# EAGLE design arduino-shield-xyzhbridge-stepper-v1 (EAGLE 9.6.2)
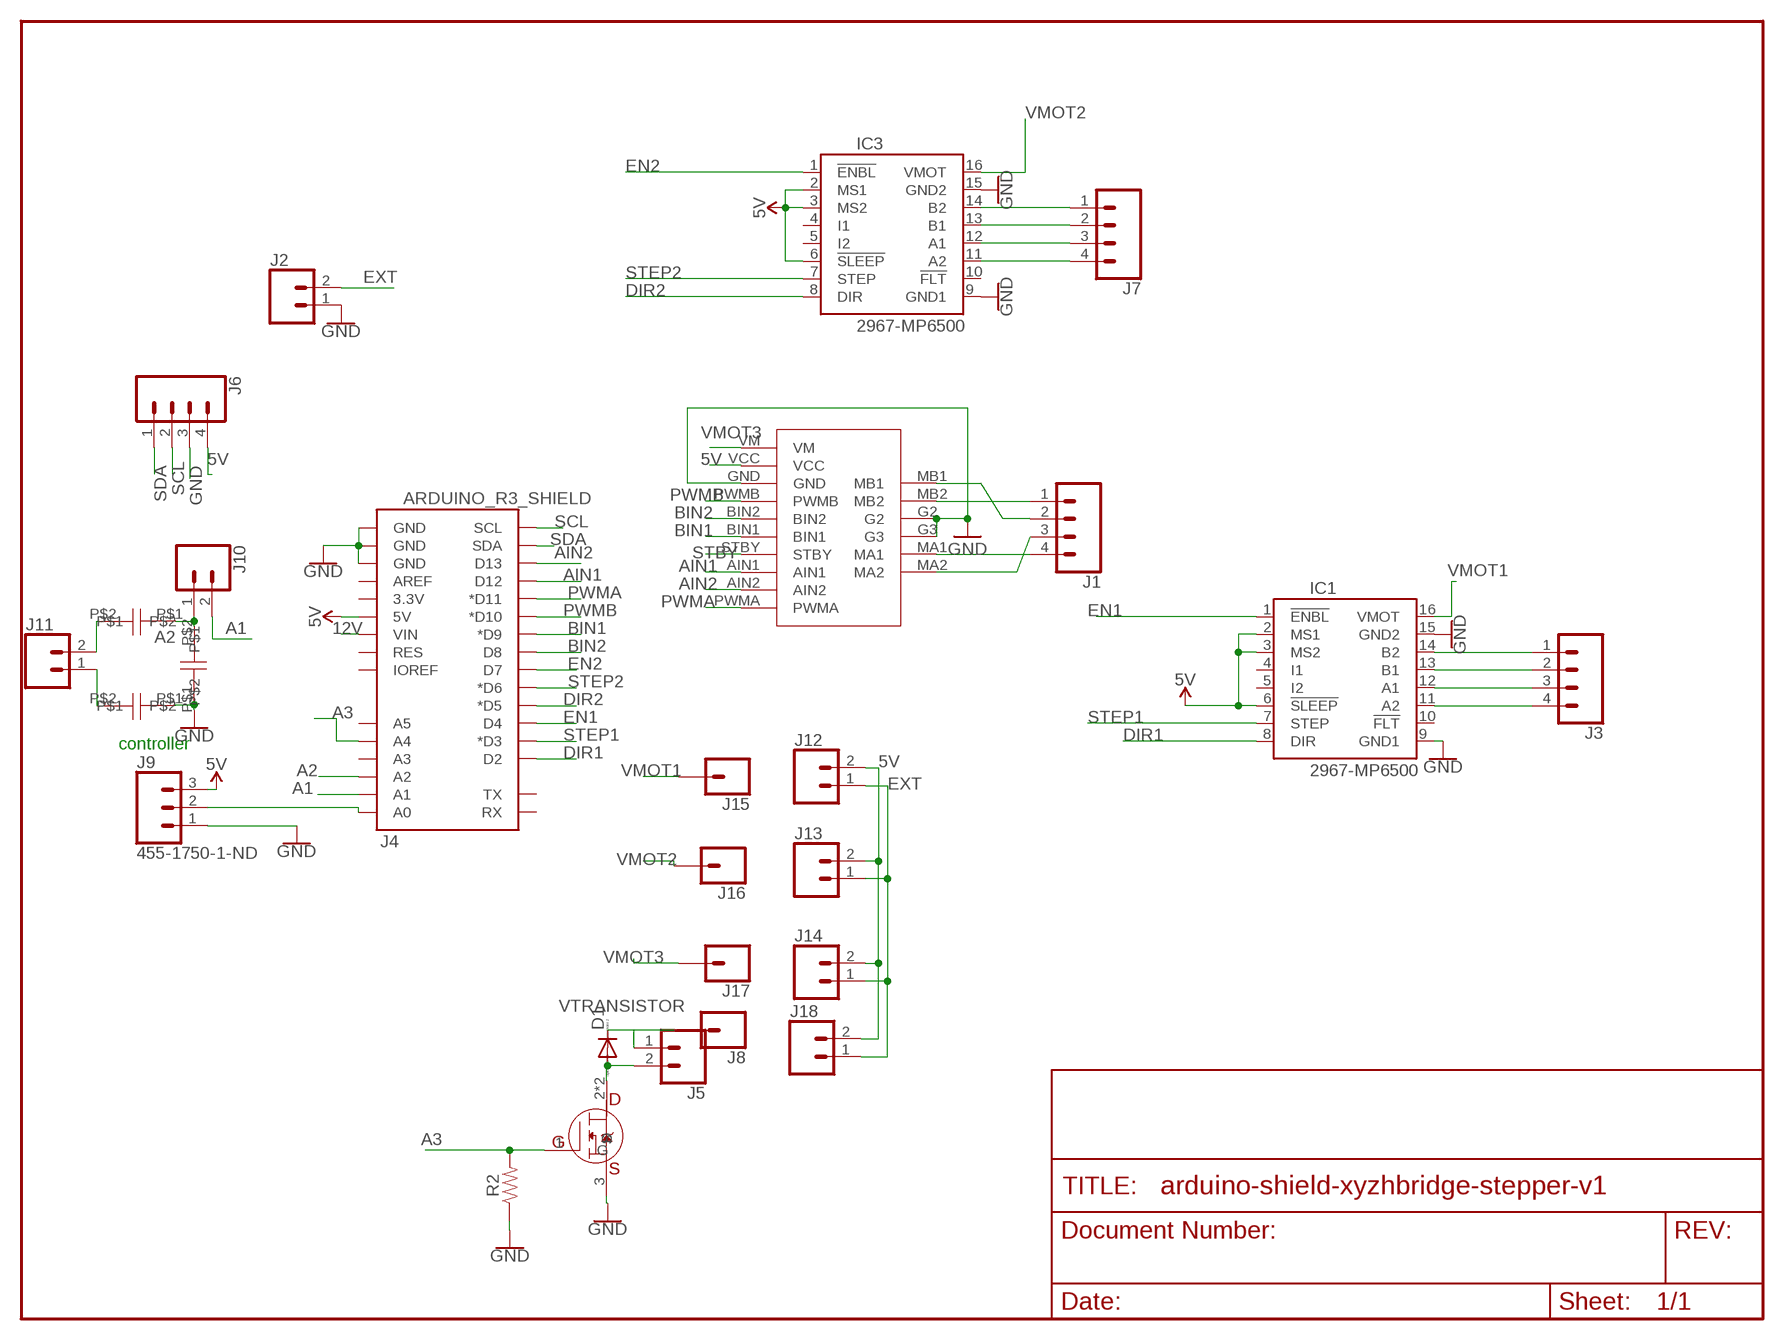
[diagram p0: schematic, sheet 1]

## Parts
D1  DIODE-DO-214AC  [DO-214AC]
IC1  2967-MP6500  [MP6500]
IC3  2967-MP6500  [MP6500]
J1  CONN_04  [1X04]
J2  CONN_02  [1X02]
J3  CONN_04  [1X04]
J4  ARDUINO_R3_SHIELD  [UNO_R3_SHIELD]
J5  CONN_02  [1X02]
J6  CONN_04  [1X04]
J7  CONN_04  [1X04]
J8  CONN_01  [1X01]
J9  455-1750-1-ND  CONN_03  [1X03]
J10  CONN_02  [1X02]
J11  CONN_02  [1X02]
J12  CONN_02  [1X02]
J13  CONN_02  [1X02]
J14  CONN_02  [1X02]
J15  CONN_01  [1X01]
J16  CONN_01  [1X01]
J17  CONN_01  [1X01]
J18  CONN_02  [1X02]
R2  RESISTORAXIAL-0.3  [AXIAL-0.3]
U$1  ADAFRUIT-TB6612  [ADAFRUIT-TB6612]
U$2  AXIALCAP  [AXIALCAP]
U$3  AXIALCAP  [AXIALCAP]
U$4  AXIALCAP  [AXIALCAP]
U$5  IRFL024NPBF  [SOT223]

## Nets
5V: IC1.2(MS1) IC1.3(MS2) IC1.6(!SLEEP) IC3.2(MS1) IC3.3(MS2) IC3.6(!SLEEP) J4.5V J6.4 J9.3 J12.2 J13.2 J14.2 J18.2 U$1.VCC
12V: J4.VIN
A1: J4.A1 J10.2
A2: J4.A2 J10.1 U$3.P$2 U$4.P$1
A3: J4.A4 R2.P$2 U$5.1(G)
AIN1: J4.D12 U$1.AIN1
AIN2: J4.D13 U$1.AIN2
BIN1: J4.D9(*D9) U$1.BIN1
BIN2: J4.D8 U$1.BIN2
DIR1: IC1.8(DIR) J4.D2
DIR2: IC3.8(DIR) J4.D5(*D5)
EN1: IC1.1(!ENBL) J4.D4
EN2: IC3.1(!ENBL) J4.D7
EXT: J2.2 J12.1 J13.1 J14.1 J18.1
GND [vcc]: IC1.9(GND1) IC1.15(GND2) IC3.9(GND1) IC3.15(GND2) J2.1 J4.GND@0(GND) J4.GND@1(GND) J4.GND@2(GND) J6.3 J9.1 R2.P$1 U$1.G2 U$1.G3 U$1.GND U$2.P$1 U$3.P$1 U$5.3(S)
N$1: IC3.14(B2) J7.1
N$4: IC3.13(B1) J7.2
N$5: IC1.14(B2) J3.1
N$6: IC1.13(B1) J3.2
N$7: IC1.12(A1) J3.3
N$8: IC1.11(A2) J3.4
N$11: J1.2 U$1.MB1
N$12: J1.1 U$1.MB2
N$13: IC3.12(A1) J7.3
N$14: IC3.11(A2) J7.4
N$15: J4.A0 J9.2
N$16: J1.4 U$1.MA1
N$17: J1.3 U$1.MA2
N$18: D1.A J5.2 U$5.2(D) U$5.4(D)
N$19: J11.2 U$4.P$2
N$22: J11.1 U$2.P$2
PWMA: J4.D11(*D11) U$1.PWMA
PWMB: J4.D10(*D10) U$1.PWMB
SCL: J4.SCL J6.2
SDA: J4.SDA J6.1
STBY: U$1.STBY
STEP1: IC1.7(STEP) J4.D3(*D3)
STEP2: IC3.7(STEP) J4.D6(*D6)
VMOT1: IC1.16(VMOT) J15.1
VMOT2: IC3.16(VMOT) J16.1
VMOT3: J17.1 U$1.VM
VTRANSISTOR: D1.C J5.1 J8.1
Unconnected: IC1.4(I1) IC1.5(I2) IC1.10(!FLT) IC3.4(I1) IC3.5(I2) IC3.10(!FLT) J4.3.3V J4.A3 J4.A5 J4.AREF J4.IOREF J4.RES J4.RX J4.TX

## Notes on the sheet
- controller

## Library data of the parts
D1 = diode:DIODE-: DIODE
IC1 IC3 = pololu-stepper-driver:2967-MP6500: MP6500 Stepper Motor Driver Carrier; Potentiometer Current Control (Header Pins Soldered) #2967 MP6500 Stepper Motor Driver Carrier; Potentiometer Current Control (Header Pins Soldered) <https://www.pololu.com/product/2967> in Japan, Suzaku Lab. Ltd. <https://suzakugiken.jp/> #2967 MP6500ステッピングモータドライバボード ポテンショメータ式電流制御 (ヘッダーピン実装済み) <https://szc.jp/po2967>
J1 J3 J6 J7 = SparkFun-Connectors:CONN_04: Multi connection point. Often used as Generic Header-pin footprint for 0.1 inch spaced/style header connections On any of the 0.1 inch spaced packages, you can populate with these: Break Away Headers - Straight <https://www.sparkfun.com/products/116> (PRT-00116) Break Away Male Headers - Right Angle <https://www.sparkfun.com/products/553> (PRT-00553) Female Headers <https://www.sparkfun.com/products/115> (PRT-00115) Break Away Headers - Machine Pin <https://www.sparkfun.com/products/117> (PRT-00117) Break Away Female Headers - Swiss Machine Pin <https://www.sparkfun.com/products/743> (PRT-00743) For SCREWTERMINALS and SPRING TERMINALS visit here: Screw Terimnals on SparkFun.com <https://www.sparkfun.com/search/results?term=Screw+Terminals> (5mm/3.5mm/2.54mm spacing) This device is also useful as a general connection point to wire up your design to another part of your project. Our various solder wires solder well into these plated through hole pads. Hook-Up Wire - Assortment (Stranded, 22 AWG) <https://www.sparkfun.com/products/11375> (PRT-11375) Hook-Up Wire - Assortment (Solid Core, 22 AWG) <https://www.sparkfun.com/products/11367> (PRT-11367) View the entire wire category on our website here <https://www.sparkfun.com/categories/141> Special notes: Molex polarized connector foot print use with SKU : PRT-08231 with associated crimp pins and housings. 1MM SMD Version SKU: PRT-10208; PROD_ID: CONN-09696
J2 J5 J10-J14 J18 = SparkFun-Connectors:CONN_02: Multi connection point. Often used as Generic Header-pin footprint for 0.1 inch spaced/style header connections On any of the 0.1 inch spaced packages, you can populate with these: Break Away Headers - Straight <https://www.sparkfun.com/products/116> (PRT-00116) Break Away Male Headers - Right Angle <https://www.sparkfun.com/products/553> (PRT-00553) Female Headers <https://www.sparkfun.com/products/115> (PRT-00115) Break Away Headers - Machine Pin <https://www.sparkfun.com/products/117> (PRT-00117) Break Away Female Headers - Swiss Machine Pin <https://www.sparkfun.com/products/743> (PRT-00743) For SCREWTERMINALS and SPRING TERMINALS visit here: Screw Terimnals on SparkFun.com <https://www.sparkfun.com/search/results?term=Screw+Terminals> (5mm/3.5mm/2.54mm spacing) This device is also useful as a general connection point to wire up your design to another part of your project. Our various solder wires solder well into these plated through hole pads. Hook-Up Wire - Assortment (Stranded, 22 AWG) <https://www.sparkfun.com/products/11375> (PRT-11375) Hook-Up Wire - Assortment (Solid Core, 22 AWG) <https://www.sparkfun.com/products/11367> (PRT-11367) View the entire wire category on our website here <https://www.sparkfun.com/categories/141> Special notes: Molex polarized connector foot print use with: PRT-08233 with associated crimp pins and housings. 2.54_SCREWTERM for use with PRT-10571. 3.5mm Screw Terminal footprints for PRT-08084 5mm Screw Terminal footprints for use with PRT-08432
J4 = SparkFun-Boards:ARDUINO_R3_SHIELD: Shield form compatible with the Arduino Uno R3.
J8 J15-J17 = SparkFun-Connectors:CONN_01: Single connection point. Often used as Generic Header-pin footprint for 0.1 inch spaced/style header connections On any of the 0.1 inch spaced packages, you can populate with these: Break Away Headers - Straight <https://www.sparkfun.com/products/116> (PRT-00116) Break Away Male Headers - Right Angle <https://www.sparkfun.com/products/553> (PRT-00553) Female Headers <https://www.sparkfun.com/products/115> (PRT-00115) Break Away Headers - Machine Pin <https://www.sparkfun.com/products/117> (PRT-00117) Break Away Female Headers - Swiss Machine Pin <https://www.sparkfun.com/products/743> (PRT-00743) This device is also useful as a general connection point to wire up your design to another part of your project. Our various solder wires solder well into these plated through hole pads. Hook-Up Wire - Assortment (Stranded, 22 AWG) <https://www.sparkfun.com/products/11375> (PRT-11375) Hook-Up Wire - Assortment (Solid Core, 22 AWG) <https://www.sparkfun.com/products/11367> (PRT-11367) View the entire wire category on our website here <https://www.sparkfun.com/categories/141> Special notes: SMTSO-256-ET is a "flush mount" nut for a 4-40 screw. We mostly use this on specialty testbeds; it is a nice way to connect hardware to your PCB at an adjustable hieght. Also note, the SNAP packages are for using a snappable style connector. We sell a baggie of snaps and they are also used on two LilyPad designs: Snap Assortment - 30 pack (male and female) <https://www.sparkfun.com/products/11347> (DEV-11347) LilyPad Arduino SimpleSnap <https://www.sparkfun.com/products/10941> (DEV-10941) LilyPad SimpleSnap Protoboard <https://www.sparkfun.com/products/10940> (DEV-10940)
J9 = SparkFun-Connectors:CONN_03: Multi connection point. Often used as Generic Header-pin footprint for 0.1 inch spaced/style header connections On any of the 0.1 inch spaced packages, you can populate with these: Break Away Headers - Straight <https://www.sparkfun.com/products/116> (PRT-00116) Break Away Male Headers - Right Angle <https://www.sparkfun.com/products/553> (PRT-00553) Female Headers <https://www.sparkfun.com/products/115> (PRT-00115) Break Away Headers - Machine Pin <https://www.sparkfun.com/products/117> (PRT-00117) Break Away Female Headers - Swiss Machine Pin <https://www.sparkfun.com/products/743> (PRT-00743) Stackable Header - 3 Pin (Female, 0.1") <https://www.sparkfun.com/products/13875> (PRT-13875) For SCREWTERMINALS and SPRING TERMINALS visit here: Screw Terimnals on SparkFun.com <https://www.sparkfun.com/search/results?term=Screw+Terminals> (5mm/3.5mm/2.54mm spacing) This device is also useful as a general connection point to wire up your design to another part of your project. Our various solder wires solder well into these plated through hole pads. Hook-Up Wire - Assortment (Stranded, 22 AWG) <https://www.sparkfun.com/products/11375> (PRT-11375) Hook-Up Wire - Assortment (Solid Core, 22 AWG) <https://www.sparkfun.com/products/11367> (PRT-11367) View the entire wire category on our website here <https://www.sparkfun.com/categories/141> Special notes: Molex polarized connector foot print use with SKU : PRT-08232 with associated crimp pins and housings.; PROD_ID: XXX-00000
R2 = SparkFun-Resistors:RESISTOR: Generic Resistor Package
U$1 = spietz-library-2:ADAFRUIT-TB6612
U$2-U$4 = spietz-library-2:AXIALCAP
U$5 = spietz-library-2:IRFL024NPBF

## Net classes
0 default: width 0.203 mm
1 vcc: width 0.178 mm

## Board
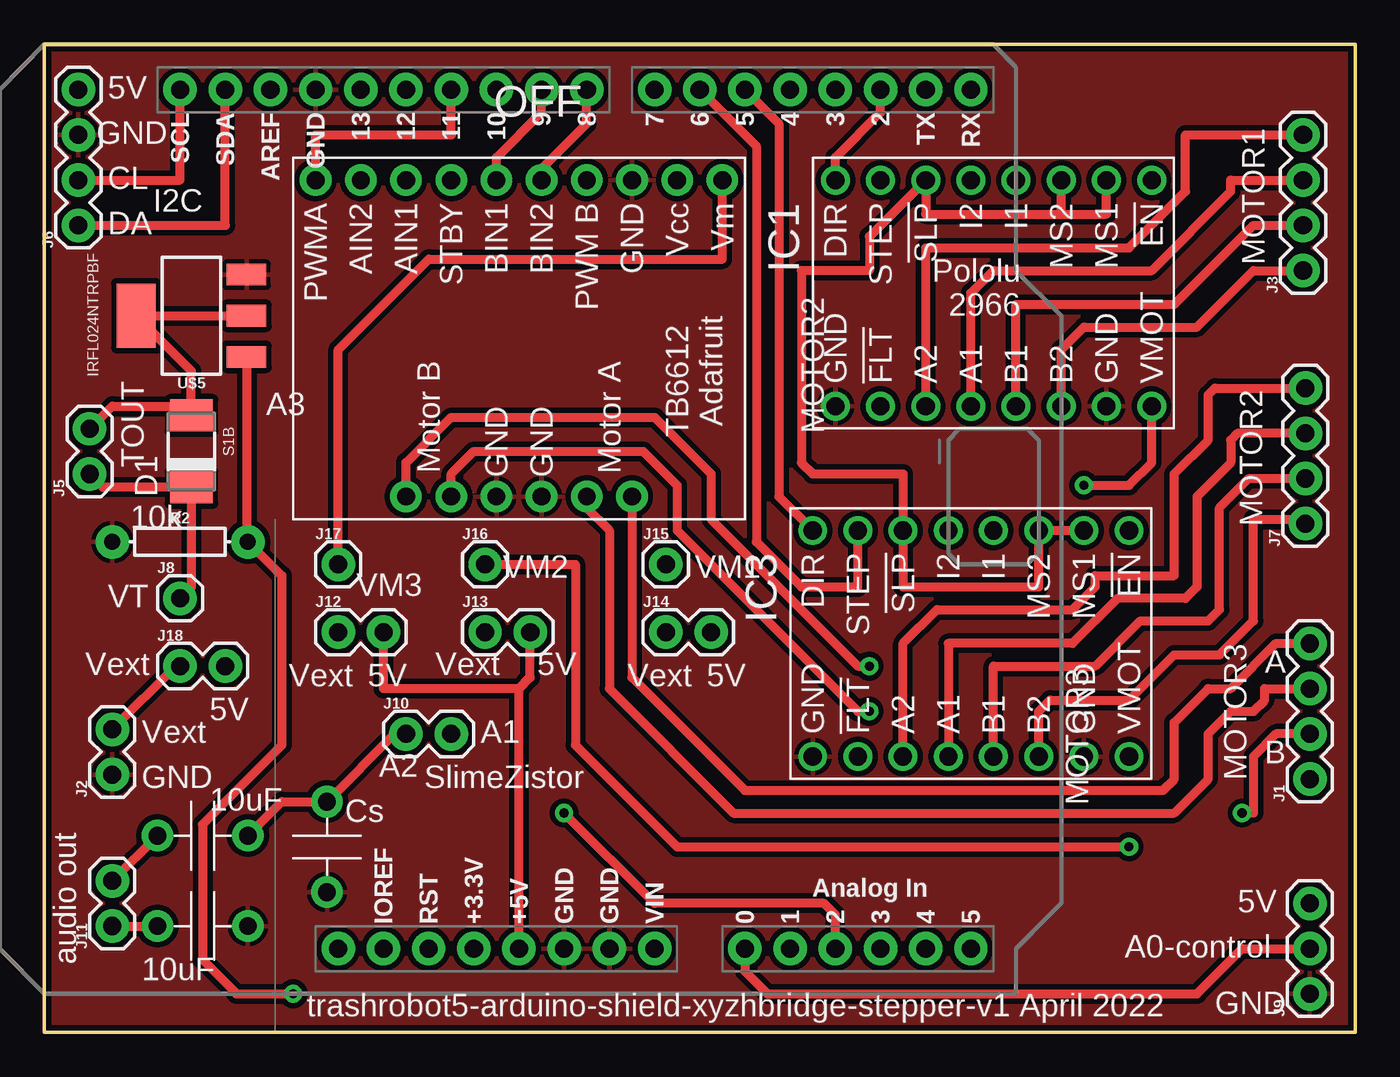
[diagram p1: board, top side]
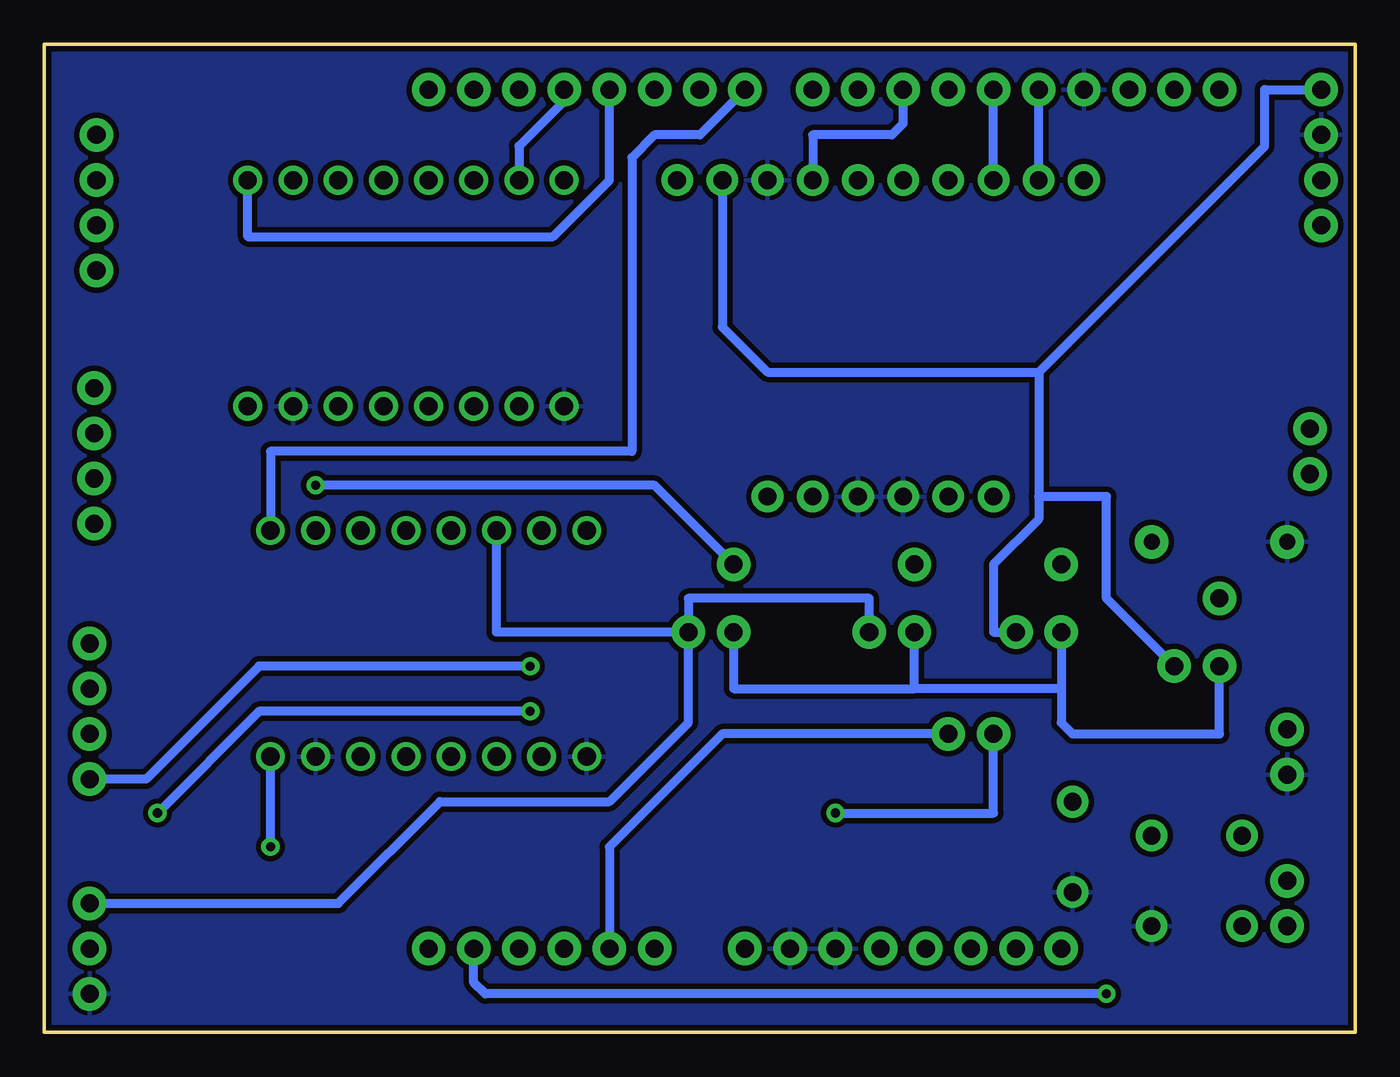
[diagram p2: board, bottom side, seen from below]

Size 73.66 x 55.5 mm. Coordinates in mm from the lower left corner, seen from the top.
Outline: 73.66,0 73.66,55.5 0,55.5 0,0 73.66,0
Copper layers (1*16): Top 0.035mm / dielectric 1.5mm / Bottom 0.035mm
Design rules "default": minimum track width 8mil, minimum drill 20mil, track to track 8mil, track to pad 8mil, pad to pad 8mil, via to via 8mil, smd to smd 8mil, copper to edge 10mil, drill to drill 8mil, minimum pad ring 12mil, minimum via ring 10mil, stop-mask expansion 4mil, vias tented up to drill 25mil, thermal gap 10mil

### Footprints (pad centres in the part's own frame; a part is rotated, then mirrored left to right if it is on the bottom)
DO-214AC = smd 1.8 x 2.4: A 2.025,0; C -2.025,0
MP6500 = drill 1.016: 1 -6.35,8.89; 2 -6.35,6.35; 3 -6.35,3.81; 4 -6.35,1.27; 5 -6.35,-1.27; 6 -6.35,-3.81; 7 -6.35,-6.35; 8 -6.35,-8.89; 9 6.35,-8.89; 10 6.35,-6.35; 11 6.35,-3.81; 12 6.35,-1.27; 13 6.35,1.27; 14 6.35,3.81; 15 6.35,6.35; 16 6.35,8.89
1X04 = drill 1.016 pad 1.88: 1 0,0; 2 2.54,0; 3 5.08,0; 4 7.62,0
1X02 = drill 1.016 pad 1.88: 1 0,0; 2 2.54,0
UNO_R3_SHIELD = drill 1.016 pad 1.88: 3.3V 50.8,26.67; 5V 50.8,29.21; A0 50.8,41.91; A1 50.8,44.45; A2 50.8,46.99; A3 50.8,49.53; A4 50.8,52.07; A5 50.8,54.61; AREF 2.54,15.24; D2 2.54,49.53; D3 2.54,46.99; D4 2.54,44.45; D5 2.54,41.91; D6 2.54,39.37; D7 2.54,36.83; D8 2.54,33.02; D9 2.54,30.48; D10 2.54,27.94; D11 2.54,25.4; D12 2.54,22.86; D13 2.54,20.32; GND@0 50.8,31.75; GND@1 50.8,34.29; GND@2 2.54,17.78; IOREF 50.8,21.59; NC 50.8,19.05; RES 50.8,24.13; RX 2.54,54.61; SCL 2.54,10.16; SDA 2.54,12.7; TX 2.54,52.07; VIN 50.8,36.83
1X01 = drill 1.016 pad 1.88: 1 0,0
1X03 = drill 1.016 pad 1.88: 1 0,0; 2 2.54,0; 3 5.08,0
AXIAL-0.3 = drill 0.9 pad 1.88: P$1 -3.81,0; P$2 3.81,0
ADAFRUIT-TB6612 = drill 1 pad 1.778: AIN1 -8.89,-6.35; AIN2 -8.89,-8.89; BIN1 -8.89,-1.27; BIN2 -8.89,1.27; G2 8.89,1.27; G3 8.89,-1.27; GND -8.89,6.35; MA1 8.89,6.35; MA2 8.89,3.81; MB1 8.89,-3.81; MB2 8.89,-6.35; PWMA -8.89,-11.43; PWMB -8.89,3.81; STBY -8.89,-3.81; VCC -8.89,8.89; VM -8.89,11.43
AXIALCAP = drill 1 pad 1.778: P$1 -2.54,0; P$2 2.54,0
SOT223 = smd 1.219 x 2.235: 1 -2.311,-3.099; 2 0,-3.099; 3 2.311,-3.099 | smd 3.6 x 2.2: 4 0,3.099

### Placement (x,y rotation side)
D1  8.25,32.64 90 top
IC1  53.34,41.53 270 top
IC3  52.07,21.84 270 top
J1  71.12,14.22 90 top
J2  3.81,14.48 90 top
J3  70.74,42.8 90 top
J4  -2.54,55.5 270 top
J5  2.54,31.37 90 top
J6  1.91,45.34 90 top
J7  70.87,28.57 90 top
J8  7.62,24.38 0 top
J9  71.12,2.16 90 top
J10  20.32,16.76 0 top
J11  3.81,5.97 90 top
J12  16.51,22.48 0 top
J13  24.77,22.48 0 top
J14  34.93,22.48 0 top
J15  34.93,26.29 0 top
J16  24.77,26.29 0 top
J17  16.51,26.29 0 top
J18  7.62,20.57 0 top
R2  7.62,27.56 0 top
U$1  26.67,38.99 270 top
U$2  8.89,5.97 180 top
U$3  15.88,10.41 90 top
U$4  8.89,11.05 180 top
U$5  8.25,40.26 90 top

### Tracks (layer width: path | path; a pad name or v marks a point on that pad's centre or on a via)
5V
  Top 0.508: 57.15,45.97 49.53,45.97 IC1.6 46.36,44.7 46.36,42.8 42.55,42.8 42.55,32 43.18,31.37 48.26,31.37 IC3.6 48.26,25.02 55.88,25.02 IC3.3 IC3.2 | 57.15,45.97 IC1.3 | 57.15,45.97 59.69,45.97 IC1.2 | J4.5V 26.67,19.3 | 26.67,19.3 27.3,19.94 J13.2 | 26.67,19.3 19.05,19.3 J12.2
  Bottom 0.508: J13.2 27.3,24.38 37.47,24.38 J14.2 | J14.2 48.26,22.48 IC3.6 | J9.3 57.15,7.24 51.44,12.95 41.91,12.95 37.47,17.4 J14.2 | U$1.VCC 35.56,39.62 33.02,37.08 17.78,37.08 | J12.2 20.32,22.48 20.32,26.29 17.78,28.83 17.78,30.1 | 17.78,37.08 17.78,30.1 | J6.4 5.08,52.96 5.08,49.78 17.78,37.08 | J18.2 13.97,24.38 13.97,30.1 17.78,30.1
A1
  Bottom 0.508: J10.2 35.56,16.76 41.91,10.41 J4.A1
A2  (via drill 0.51)
  Top 0.508: J4.A2 44.45,6.6 43.81,7.24 34.29,7.24 v29.21,12.32 | U$4.P$1 13.34,12.95 U$3.P$2 19.69,16.76 J10.1
  Bottom 0.508: v29.21,12.32 20.32,12.32 J10.1
A3  (via drill 0.51)
  Top 0.508: U$5.1 11.35,27.63 R2.P$2 13.34,25.65 13.34,16.13 8.89,11.68 8.89,4.06 10.8,2.16 v13.97,2.16
  Bottom 0.508: v13.97,2.16 48.9,2.16 49.53,2.79 J4.A4
AIN1
  Bottom 0.508: U$1.AIN1 J4.D12
AIN2
  Bottom 0.508: U$1.AIN2 J4.D13
BIN1
  Top 0.508: U$1.BIN1 25.4,49.15 27.94,51.69 J4.D9
BIN2
  Top 0.508: U$1.BIN2 27.94,48.51 30.48,51.05 J4.D8
DIR1
  Top 0.508: IC1.8 44.45,49.15 46.99,51.69 J4.D2
DIR2
  Top 0.508: J4.D5 41.27,51.05 41.27,30.1 IC3.8
EN1
  Bottom 0.508: IC1.1 62.23,44.7 45.09,44.7 41.91,47.88 J4.D4
EN2
  Bottom 0.508: J4.D7 36.83,50.42 39.37,50.42 40.64,49.15 40.64,32.64 60.96,32.64 IC3.1
EXT
  Top 0.508: J2.2 7.37,20.57 J18.1
  Bottom 0.508: J14.1 34.93,19.3 24.77,19.3 | 24.77,19.3 J13.1 | J12.1 16.51,19.3 | 16.51,19.3 24.77,19.3 | J18.1 7.62,16.76 15.88,16.76 16.51,17.4 16.51,19.3
GND
  pour Top (isolate 0.305): 74.93,-0.13 -2.79,-0.64 -2.79,55.75 74.42,55.75
  pour Bottom (isolate 0.305): 75.05,-0.38 -0.62,-0.38 -0.76,56.01 74.94,56.01
N$1
  Top 0.508: IC3.14 55.88,18.03 56.52,18.67 60.96,18.67 63.5,21.21 66.04,21.21 67.94,23.11 67.94,28.83 70.61,28.83 J7.1
N$4
  Top 0.508: IC3.13 53.34,20.57 59.05,20.57 61.6,23.11 65.4,23.11 66.04,23.75 66.04,29.46 67.69,31.11 J7.2
N$5
  Top 0.508: IC1.14 57.15,38.35 58.42,39.62 64.77,39.62 67.94,42.8 J3.1
N$6
  Top 0.508: IC1.13 54.61,40.89 63.5,40.89 67.94,45.34 J3.2
N$7
  Top 0.508: IC1.12 52.07,41.53 53.34,42.8 62.23,42.8 66.67,47.24 66.67,47.88 J3.3
N$8
  Top 0.508: IC1.11 49.53,44.07 60.96,44.07 64.13,47.24 64.13,50.42 J3.4
N$11  (via drill 0.51)
  Top 0.508: U$1.MB1 22.86,31.37 24.13,32.64 33.66,32.64 35.56,30.73 35.56,28.19 45.72,18.03 v46.36,18.03 | J1.2 69.21,16.76 67.94,15.49 67.94,12.32 v67.31,12.32
  Bottom 0.508: v46.36,18.03 61.6,18.03 v67.31,12.32
N$12  (via drill 0.51)
  Top 0.508: U$1.MB2 20.32,32 22.86,34.54 34.29,34.54 37.47,31.37 37.47,28.83 45.72,20.57 v46.36,20.57
  Bottom 0.508: v46.36,20.57 61.6,20.57 67.94,14.22 J1.1
N$13
  Top 0.508: J7.3 67.06,33.66 66.67,33.27 66.67,32 64.77,30.1 64.77,25.02 64.13,24.38 60.33,24.38 57.79,21.84 50.8,21.84 IC3.12
N$14
  Top 0.508: IC3.11 48.26,21.84 50.16,23.75 57.79,23.75 59.05,25.02 59.05,25.65 63.5,25.65 63.5,31.37 65.4,33.27 65.4,35.81 65.79,36.2 J7.4
N$15
  Top 0.508: J4.A0 39.37,3.43 40.64,2.16 64.77,2.16 67.31,4.7 J9.2
N$16
  Top 0.508: J1.4 69.21,21.84 66.67,19.3 65.4,19.3 63.5,17.4 63.5,14.22 62.87,13.59 39.37,13.59 33.02,19.94 U$1.MA1
N$17
  Top 0.508: U$1.MA2 30.48,29.46 31.75,28.19 31.75,19.3 38.73,12.32 63.5,12.32 65.4,14.22 65.4,16.76 66.67,18.03 67.94,18.03 68.58,18.67 68.58,19.3 J1.3
N$18
  Top 0.508: U$5.2 U$5.4 8.25,37.16 8.25,35.18 | D1.A 8.25,35.18 | J5.2 3.81,35.18 8.25,35.18
N$19
  Top 0.508: U$4.P$2 J11.2
N$22
  Top 0.508: J11.1 U$2.P$2
PWMA
  Top 0.508: U$1.PWMA 15.24,50.42 22.86,50.42 J4.D11
PWMB
  Bottom 0.508: J4.D10 25.4,51.05 26.04,50.42 30.48,50.42 U$1.PWMB
SCL
  Top 0.508: J6.2 7.62,47.88 J4.SCL
SDA
  Top 0.508: J6.1 10.16,45.34 J4.SDA
STEP1
  Bottom 0.508: J4.D3 44.45,52.32 46.99,49.78 IC1.7
STEP2
  Top 0.508: J4.D6 40.01,49.78 40.01,27.56 42.55,25.02 45.72,25.02 IC3.7
VMOT1  (via drill 0.51)
  Top 0.508: v58.42,30.73 60.96,30.73 62.23,32 IC1.16
  Bottom 0.508: J15.1 39.37,30.73 v58.42,30.73
VMOT2  (via drill 0.51)
  Top 0.508: J16.1 29.84,26.29 29.84,16.13 35.56,10.41 v60.96,10.41
  Bottom 0.508: v60.96,10.41 IC3.16
VMOT3
  Top 0.508: J17.1 16.51,38.35 21.59,43.43 38.1,43.43 U$1.VM
VTRANSISTOR
  Top 0.508: J5.1 3.29,30.61 D1.C 8.25,25.02 J8.1

### Text on the board
tPlace: OFF | 5V | MOTOR1 | GND | CL | I2C | DA | Pololu / 2966 | IRFL024NTRPBF | A3 | MOTOR2 | S1B | TOUT | 10k | MOTOR2 | VM2 | VM1 | VM3 | VT | MOTOR3 | MOTOR3 | A | Vext | Vext | 5V | Vext | 5V | Vext | 5V | 5V | Vext | A1 | A2 | B | GND | SlimeZistor | 10uF | Cs | 5V | A0-control | audio out | 10uF | trashrobot5-arduino-shield-xyzhbridge-stepper-v1 April 2022 | GND
tValues: Tent Vias! | Arduino Wee v1.3